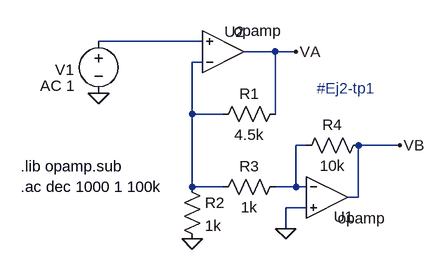
[diagram p0: schematic ej2-tp1.asc]
ej2-tp1.asc, the LTspice schematic file:
Version 4
SHEET 1 880 680
WIRE 64 64 -96 64
WIRE 176 80 128 80
WIRE 208 80 176 80
WIRE 64 96 48 96
WIRE 48 176 48 96
WIRE 96 176 48 176
WIRE 176 176 176 80
WIRE 224 224 208 224
WIRE 368 224 304 224
WIRE 48 288 48 176
WIRE 96 288 48 288
WIRE 208 288 208 224
WIRE 208 288 176 288
WIRE 224 288 208 288
WIRE 304 304 304 224
WIRE 304 304 288 304
WIRE 224 320 192 320
WIRE 192 352 192 320
FLAG -96 144 0
FLAG 208 80 VA
FLAG 48 368 0
FLAG 192 352 0
FLAG 368 224 VB
SYMBOL OpAmps\\opamp 256 240 R0
WINDOW 0 10 94 Left 2
SYMATTR InstName U1
SYMBOL voltage -96 48 R0
WINDOW 123 -90 84 Left 2
WINDOW 39 0 0 Left 0
WINDOW 0 -67 60 Left 2
SYMATTR Value2 AC 1
SYMATTR InstName V1
SYMATTR Value ""
SYMBOL OpAmps\\opamp 96 144 M180
WINDOW 0 2 95 Left 2
SYMATTR InstName U2
SYMBOL res 192 160 R90
WINDOW 0 0 56 VBottom 2
WINDOW 3 32 56 VTop 2
SYMATTR InstName R1
SYMATTR Value 4.5k
SYMBOL res 32 272 R0
SYMATTR InstName R2
SYMATTR Value 1k
SYMBOL res 192 272 R90
WINDOW 0 0 56 VBottom 2
WINDOW 3 32 56 VTop 2
SYMATTR InstName R3
SYMATTR Value 1k
SYMBOL res 320 208 R90
WINDOW 0 0 56 VBottom 2
WINDOW 3 32 56 VTop 2
SYMATTR InstName R4
SYMATTR Value 10k
TEXT -216 256 Left 2 !.lib opamp.sub
TEXT -216 288 Left 2 !.ac dec 1000 1 100k
TEXT 240 136 Left 2 ;#Ej2-tp1

The netlist it stands for:
* ej2-tp1.asc
XU1 N003 0 VB opamp Aol=100K GBW=10Meg  ; pins invin noninvin out
V1 N001 0 AC 1
XU2 N002 N001 VA opamp Aol=100K GBW=10Meg  ; pins invin noninvin out
R1 VA N002 4.5k
R2 N002 0 1k
R3 N003 N002 1k
R4 VB N003 10k
.lib opamp.sub
.ac dec 1000 1 100k
* #Ej2-tp1
.backanno
.end

* Results of the author's LTspice run, read from the files saved beside the schematic
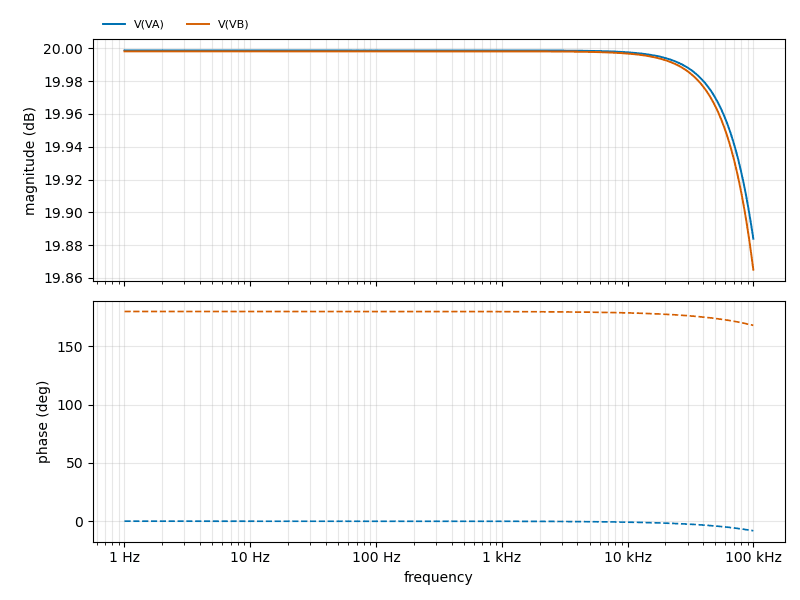
[diagram p1: AC Analysis of ej2-tp1.asc, plotted from the saved traces]
* AC Analysis, 1 run:
*   V(VA): 20.00 dB at 1 Hz, 19.88 dB at 100 kHz, peak 20.00 dB at 1.208 Hz
*   V(VB): 20.00 dB at 1 Hz, 19.87 dB at 100 kHz, peak 20.00 dB at 1 Hz